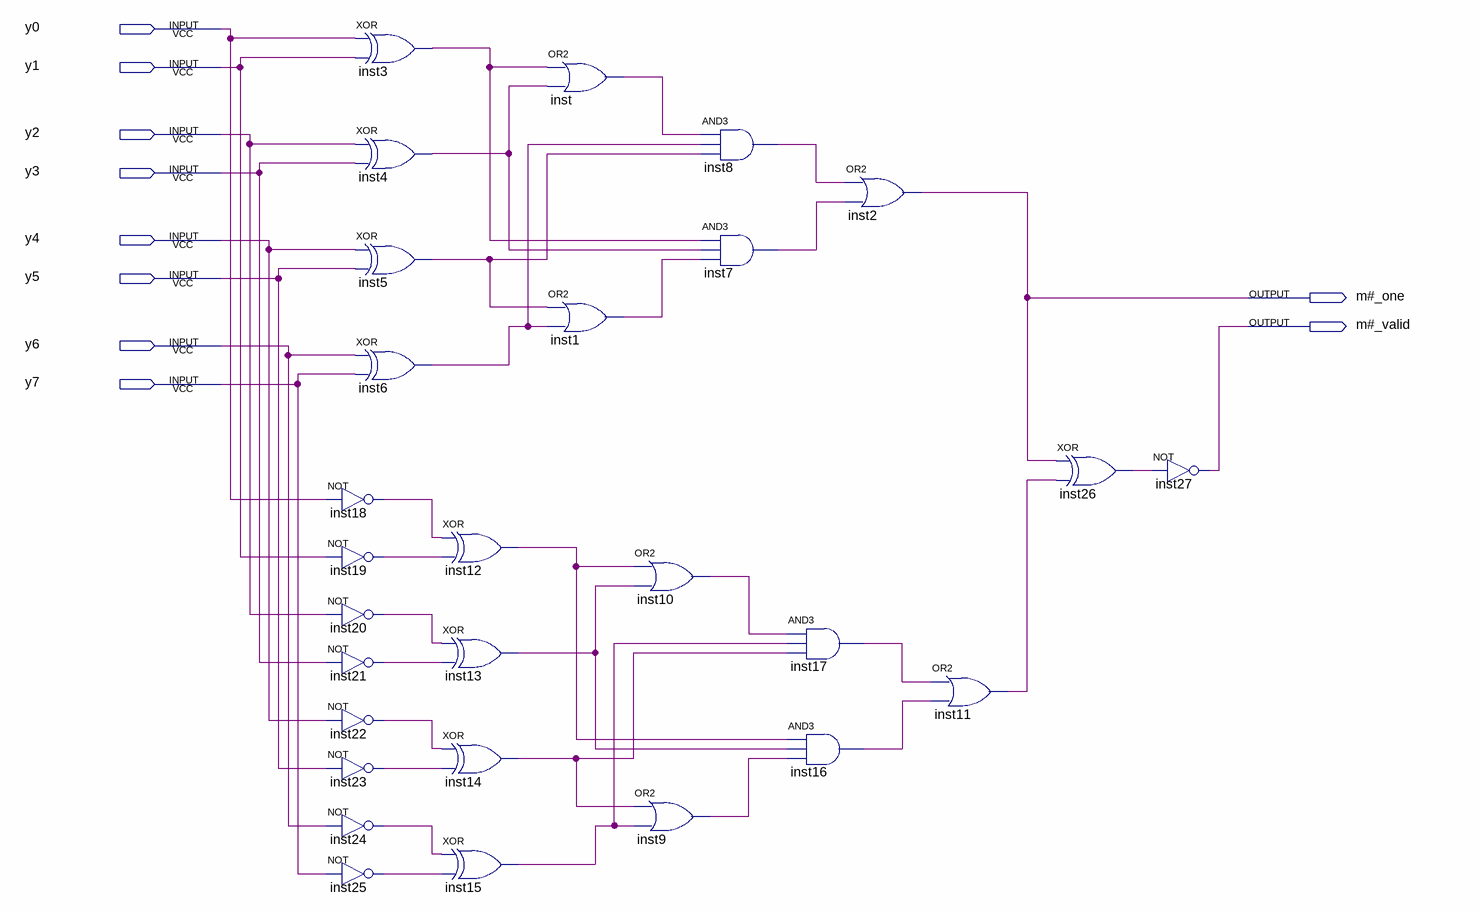
[diagram p0: schematic sheet]
// Quartus schematic m#_decode.bdf as structural Verilog: 28 symbols, 10 pins
module \m#_decode  (
  input  y0,
  input  y1,
  input  y2,
  input  y3,
  input  y4,
  input  y5,
  input  y6,
  input  y7,
  output \m#_one ,
  output \m#_valid 
);

  wire inst1_out, inst3_out, inst4_out, inst5_out, inst6_out, inst7_out, inst8_out, inst9_out, inst10_out,
       inst11_out, inst12_out, inst13_out, inst14_out, inst15_out, inst16_out, inst17_out, inst18_out,
       inst19_out, inst20_out, inst21_out, inst22_out, inst23_out, inst24_out, inst25_out, inst26_out,
       inst_out;

  xor inst3 (inst3_out, y0, y1);
  xor inst4 (inst4_out, y2, y3);
  xor inst5 (inst5_out, y4, y5);
  xor inst6 (inst6_out, y6, y7);
  not inst18 (inst18_out, y0);
  not inst19 (inst19_out, y1);
  not inst20 (inst20_out, y2);
  not inst21 (inst21_out, y3);
  not inst22 (inst22_out, y4);
  not inst23 (inst23_out, y5);
  not inst24 (inst24_out, y6);
  not inst25 (inst25_out, y7);
  xor inst12 (inst12_out, inst18_out, inst19_out);
  xor inst13 (inst13_out, inst20_out, inst21_out);
  xor inst14 (inst14_out, inst22_out, inst23_out);
  xor inst15 (inst15_out, inst24_out, inst25_out);
  or inst (inst_out, inst3_out, inst4_out);
  or inst1 (inst1_out, inst5_out, inst6_out);
  or inst10 (inst10_out, inst12_out, inst13_out);
  or inst9 (inst9_out, inst14_out, inst15_out);
  and inst8 (inst8_out, inst_out, inst6_out, inst5_out);
  and inst7 (inst7_out, inst3_out, inst4_out, inst1_out);
  and inst17 (inst17_out, inst10_out, inst15_out, inst14_out);
  and inst16 (inst16_out, inst12_out, inst13_out, inst9_out);
  or inst2 (\m#_one , inst8_out, inst7_out);
  or inst11 (inst11_out, inst17_out, inst16_out);
  xor inst26 (inst26_out, \m#_one , inst11_out);
  not inst27 (\m#_valid , inst26_out);
endmodule
